# EAGLE design teensy_PCB_v4 (EAGLE 7.7.0)
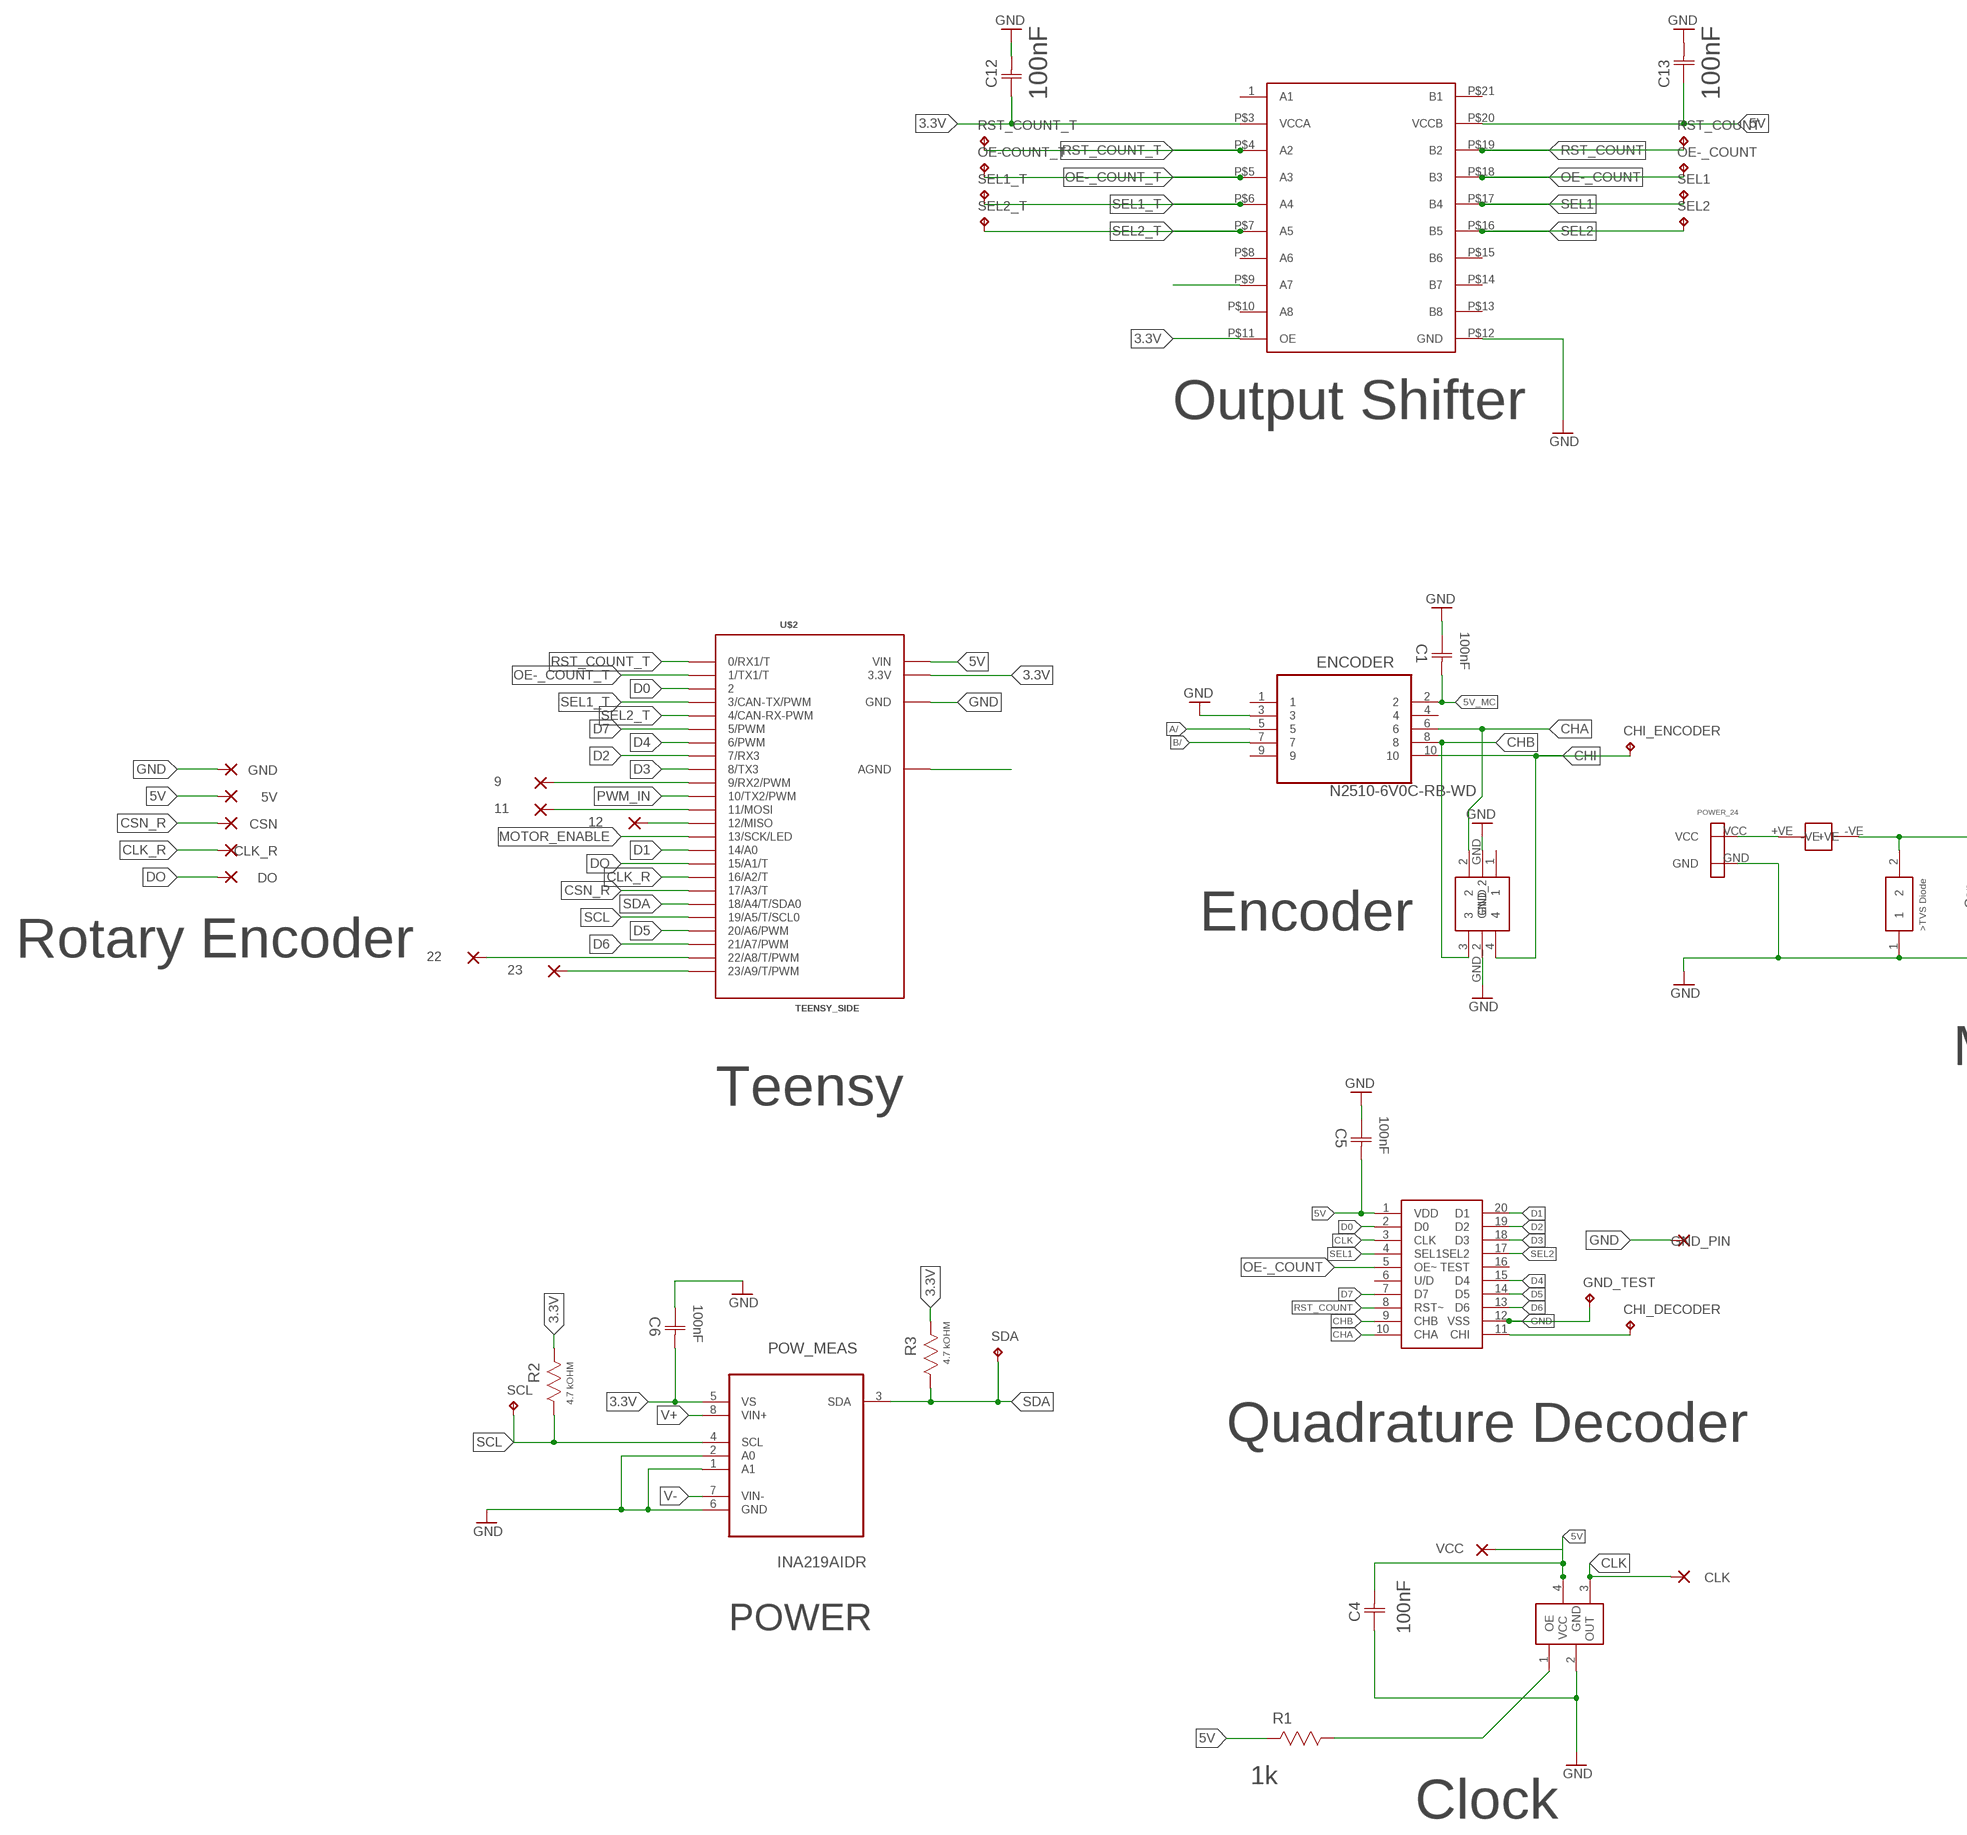
[diagram p0: schematic, sheet 1, part 1 of 2]
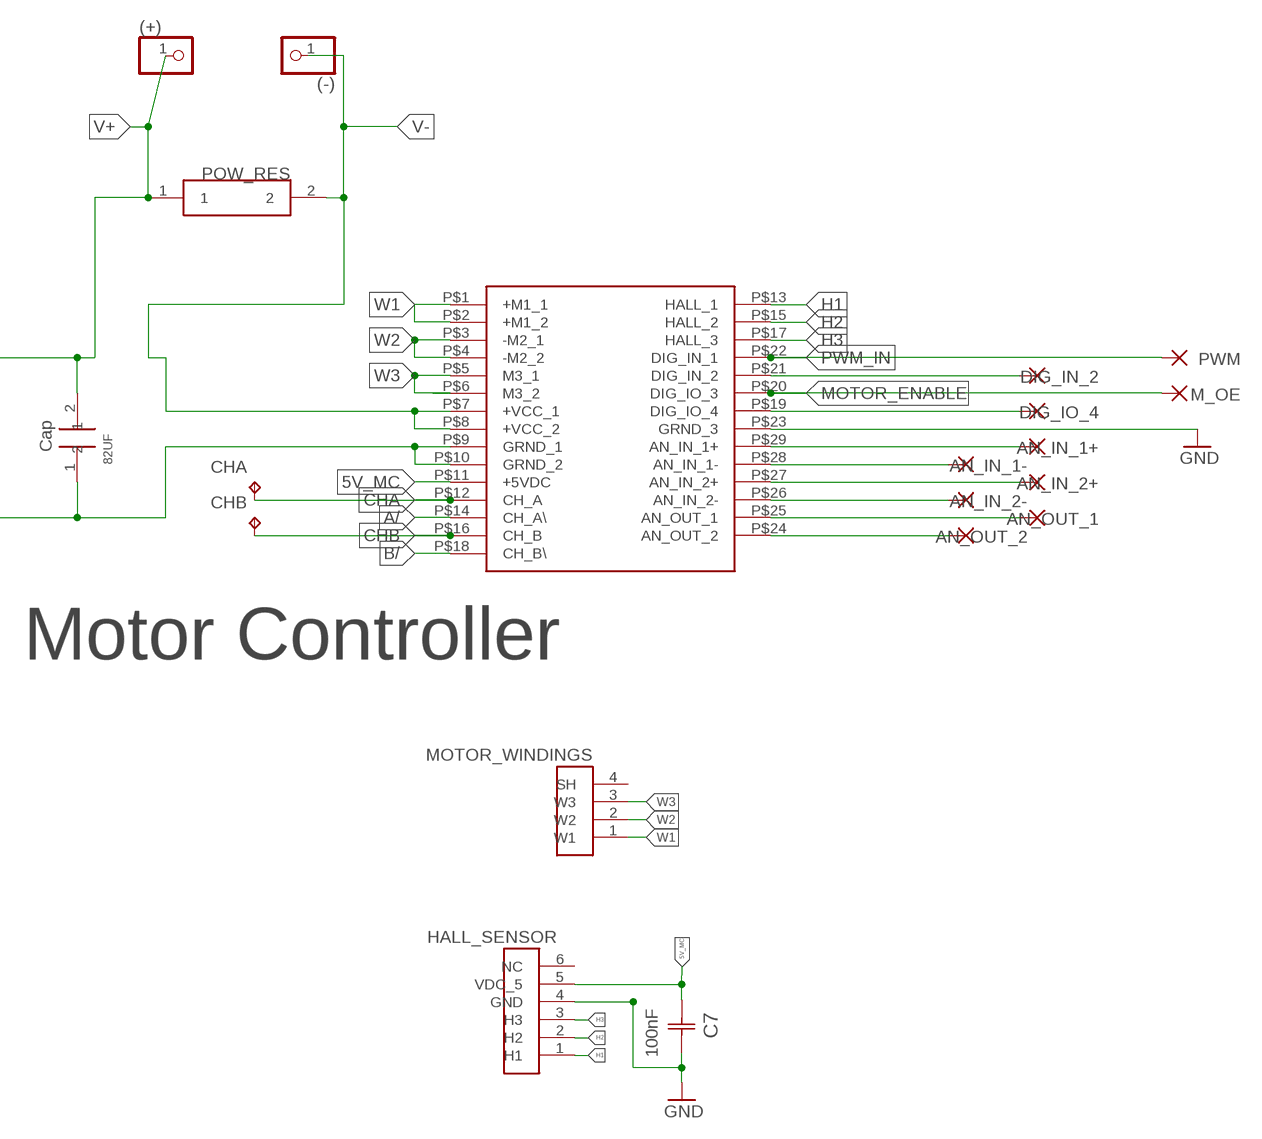
[diagram p1: schematic, sheet 1, part 2 of 2]

## Parts
5V  WIREPAD1,6/0,8  [1,6/0,8]
9  WIREPAD1,6/0,8  [1,6/0,8]
11  WIREPAD1,6/0,8  [1,6/0,8]
12  WIREPAD1,6/0,8  [1,6/0,8]
22  WIREPAD1,6/0,8  [1,6/0,8]
23  WIREPAD1,6/0,8  [1,6/0,8]
(+)  PINHD-1X1  [1X01]
(-)  PINHD-1X1  [1X01]
AN_IN_1+  WIREPAD1,6/0,8  [1,6/0,8]
AN_IN_1-  WIREPAD1,6/0,8  [1,6/0,8]
AN_IN_2+  WIREPAD1,6/0,8  [1,6/0,8]
AN_IN_2-  WIREPAD1,6/0,8  [1,6/0,8]
AN_OUT_1  WIREPAD1,6/0,8  [1,6/0,8]
AN_OUT_2  WIREPAD1,6/0,8  [1,6/0,8]
C1  100nF  U0805F104ZCT  [CAPC2013X90N]
C4  100nF  U0805F104ZCT  [CAPC2013X90N]
C5  100nF  U0805F104ZCT  [CAPC2013X90N]
C6  100nF  U0805F104ZCT  [CAPC2013X90N]
C7  100nF  U0805F104ZCT  [CAPC2013X90N]
C12  100nF  CAP_0805_100NF  [CAP_0805_100NF]
C13  100nF  CAP_0805_100NF  [CAP_0805_100NF]
CAP82UF  82UF  CAP_82UF  [CAP_82UF]
CHA  TPTP10SQ  [TP10SQ]
CHB  TPTP10SQ  [TP10SQ]
CHI_DECODER  TPTP10SQ  [TP10SQ]
CHI_ENCODER  TPTP10SQ  [TP10SQ]
CLK  WIREPAD1,6/0,8  [1,6/0,8]
CLK_R  WIREPAD1,6/0,8  [1,6/0,8]
CLOCK  CLOCK_14MHZ  [CLOCK_14MHZ]
CSN  WIREPAD1,6/0,8  [1,6/0,8]
DIG_IN_2  WIREPAD1,6/0,8  [1,6/0,8]
DIG_IO_4  WIREPAD1,6/0,8  [1,6/0,8]
DO  WIREPAD1,6/0,8  [1,6/0,8]
ENCODER  N2510-6V0C-RB-WD  [3M_N2510-6V0C-RB-WD]
ENCODER_DIODE  ENCODER_DIODE_ESDA14V2BP6  [ENCODER_DIODE_ESDA14V2BP6]
FUSE_HOLDER  FUSE_HOLDER  [FUSE_HOLDER]
GND  WIREPAD1,6/0,8  [1,6/0,8]
GND_PIN  WIREPAD1,6/0,8  [1,6/0,8]
GND_TEST  TPTP10SQ  [TP10SQ]
HALL_SENSOR  HALL_SENSOR_SOCKET_6POS  [HALL_SENSOR_SOCKET_6POS]
M_OE  WIREPAD1,6/0,8  [1,6/0,8]
MOTOR_CONTROLLER  MAXON_438725THROUGH_HOLE  [MAXON_MOTOR_CONTROLLER]
MOTOR_WINDINGS  MOTOR_HEADER_4POS  [MOTOR_HEADER_4POS]
OE-_COUNT  TPTP10SQ  [TP10SQ]
OE-COUNT_T  TPTP10SQ  [TP10SQ]
POW_MEAS  INA219AIDR  [SOIC127P600X175-8N]
POWER_RESISTOR  POWER_RESISTOR  [POWER_RESISTOR]
PWM  WIREPAD1,6/0,8  [1,6/0,8]
QUADRATURE_DECODER  HCTL-2022  [HCTL-2022]
R1  1k  ERA-3AEB102V  [RESC1608X60N]
R2  4.7 kOHM  ERJ-6ENF4701V  [RESC2013X65N]
R3  4.7 kOHM  ERJ-6ENF4701V  [RESC2013X65N]
RST_COUNT  TPTP10SQ  [TP10SQ]
RST_COUNT_T  TPTP10SQ  [TP10SQ]
SCL  TPTP10SQ  [TP10SQ]
SDA  TPTP10SQ  [TP10SQ]
SEL1  TPTP10SQ  [TP10SQ]
SEL1_T  TPTP10SQ  [TP10SQ]
SEL2  TPTP10SQ  [TP10SQ]
SEL2_T  TPTP10SQ  [TP10SQ]
TVS_DIODE  TVS_SMBJ33A-E3/52  [TVS_SMBJ33A-E3/52]
U$2  TEENSY_SIDE  [TEENSY_SIDE]
U$3  TXS0108PWR  [TXS0108PWR]
U$5  POWER_2POS  [POWER_2POS]
VCC  WIREPAD1,6/0,8  [1,6/0,8]

## Nets
3.3V: C6.2(C2) C12.1(C1) POW_MEAS.5(VS) R2.1(R1) R3.1(R1) U$2.3.3V U$3.P$3(VCCA) U$3.P$11(OE)
5V: 5V.1(P) C4.2(C2) C5.2(C2) C13.1(C1) CLOCK.4(VCC) QUADRATURE_DECODER.1(VDD) R1.2(R2) U$2.VIN U$3.P$20(VCCB) VCC.1(P)
5V_MC: C1.2(C2) C7.2(C2) ENCODER.2 HALL_SENSOR.5(VDC_5) MOTOR_CONTROLLER.P$11(+5VDC)
A/: ENCODER.5 MOTOR_CONTROLLER.P$14(CH_A\\)
B/: ENCODER.7 MOTOR_CONTROLLER.P$18(CH_B\\)
CHA: CHA.TP ENCODER.6 ENCODER_DIODE.2 MOTOR_CONTROLLER.P$12(CH_A) QUADRATURE_DECODER.10(CHA)
CHB: CHB.TP ENCODER.8 ENCODER_DIODE.3 MOTOR_CONTROLLER.P$16(CH_B) QUADRATURE_DECODER.9(CHB)
CHI: CHI_ENCODER.TP ENCODER.10 ENCODER_DIODE.4
CLK: CLK.1(P) CLOCK.3(OUT) QUADRATURE_DECODER.3(CLK)
CLK_R: CLK_R.1(P) U$2.16/A2(16/A2/T)
CSN_R: CSN.1(P) U$2.17/A3(17/A3/T)
D0: QUADRATURE_DECODER.2(D0) U$2.2
D1: QUADRATURE_DECODER.20(D1) U$2.14/A0
D2: QUADRATURE_DECODER.19(D2) U$2.7(7/RX3)
D3: QUADRATURE_DECODER.18(D3) U$2.8(8/TX3)
D4: QUADRATURE_DECODER.15(D4) U$2.6(6/PWM)
D5: QUADRATURE_DECODER.14(D5) U$2.20/A6(20/A6/PWM)
D6: QUADRATURE_DECODER.13(D6) U$2.21/A7(21/A7/PWM)
D7: QUADRATURE_DECODER.7(D7) U$2.5(5/PWM)
DO: DO.1(P) U$2.15/A1(15/A1/T)
GND: C1.1(C1) C4.1(C1) C5.1(C1) C6.1(C1) C7.1(C1) C12.2(C2) C13.2(C2) CAP82UF.1 CLOCK.2(GND) ENCODER.3 ENCODER_DIODE.GND ENCODER_DIODE.GND_2 GND.1(P) GND_PIN.1(P) GND_TEST.TP HALL_SENSOR.4(GND) MOTOR_CONTROLLER.P$9(GRND_1) MOTOR_CONTROLLER.P$10(GRND_2) MOTOR_CONTROLLER.P$23(GRND_3) POW_MEAS.1(A1) POW_MEAS.2(A0) POW_MEAS.6(GND) QUADRATURE_DECODER.12(VSS) TVS_DIODE.1 U$2.GND U$3.P$12(GND) U$5.GND
H1: HALL_SENSOR.1(H1) MOTOR_CONTROLLER.P$13(HALL_1)
H2: HALL_SENSOR.2(H2) MOTOR_CONTROLLER.P$15(HALL_2)
H3: HALL_SENSOR.3(H3) MOTOR_CONTROLLER.P$17(HALL_3)
MOTOR_ENABLE: M_OE.1(P) MOTOR_CONTROLLER.P$20(DIG_IO_3) U$2.13(13/SCK/LED)
MOTOR_ENABLE_T: U$3.P$9(A7)
N$1: FUSE_HOLDER.+VE U$5.VCC
N$2: DIG_IN_2.1(P) MOTOR_CONTROLLER.P$21(DIG_IN_2)
N$3: DIG_IO_4.1(P) MOTOR_CONTROLLER.P$19(DIG_IO_4)
N$4: CLOCK.1(OE) R1.1(R1)
N$5: AN_IN_1+.1(P) MOTOR_CONTROLLER.P$29(AN_IN_1+)
N$6: AN_IN_1-.1(P) MOTOR_CONTROLLER.P$28(AN_IN_1-)
N$7: AN_IN_2+.1(P) MOTOR_CONTROLLER.P$27(AN_IN_2+)
N$8: AN_IN_2-.1(P) MOTOR_CONTROLLER.P$26(AN_IN_2-)
N$9: CHI_DECODER.TP QUADRATURE_DECODER.11(CHI)
N$10: AN_OUT_1.1(P) MOTOR_CONTROLLER.P$25(AN_OUT_1)
N$11: AN_OUT_2.1(P) MOTOR_CONTROLLER.P$24(AN_OUT_2)
N$12: 11.1(P) U$2.11(11/MOSI)
N$13: 12.1(P) U$2.12(12/MISO)
N$17: 9.1(P) U$2.9(9/RX2/PWM)
N$35: 22.1(P) U$2.22/A8(22/A8/T/PWM)
N$36: 23.1(P) U$2.23/A9(23/A9/T/PWM)
N$40: U$2.AGND
OE-_COUNT: OE-_COUNT.TP QUADRATURE_DECODER.5(OE~) U$3.P$18(B3)
OE-_COUNT_T: OE-COUNT_T.TP U$2.1(1/TX1/T) U$3.P$5(A3)
PWM_IN: MOTOR_CONTROLLER.P$22(DIG_IN_1) PWM.1(P) U$2.10(10/TX2/PWM)
RST_COUNT: QUADRATURE_DECODER.8(RST~) RST_COUNT.TP U$3.P$19(B2)
RST_COUNT_T: RST_COUNT_T.TP U$2.0(0/RX1/T) U$3.P$4(A2)
SCL: POW_MEAS.4(SCL) R2.2(R2) SCL.TP U$2.19/A5(19/A5/T/SCL0)
SDA: POW_MEAS.3(SDA) R3.2(R2) SDA.TP U$2.18/A4(18/A4/T/SDA0)
SEL1: QUADRATURE_DECODER.4(SEL1) SEL1.TP U$3.P$17(B4)
SEL1_T: SEL1_T.TP U$2.3(3/CAN-TX/PWM) U$3.P$6(A4)
SEL2: QUADRATURE_DECODER.17(SEL2) SEL2.TP U$3.P$16(B5)
SEL2_T: SEL2_T.TP U$2.4(4/CAN-RX-PWM) U$3.P$7(A5)
V+: (+).1 CAP82UF.2 FUSE_HOLDER.-VE POW_MEAS.8(VIN+) POWER_RESISTOR.1 TVS_DIODE.2
V-: (-).1 MOTOR_CONTROLLER.P$7(+VCC_1) MOTOR_CONTROLLER.P$8(+VCC_2) POW_MEAS.7(VIN-) POWER_RESISTOR.2
W1: MOTOR_CONTROLLER.P$1(+M1_1) MOTOR_CONTROLLER.P$2(+M1_2) MOTOR_WINDINGS.1(W1)
W2: MOTOR_CONTROLLER.P$3(-M2_1) MOTOR_CONTROLLER.P$4(-M2_2) MOTOR_WINDINGS.2(W2)
W3: MOTOR_CONTROLLER.P$5(M3_1) MOTOR_CONTROLLER.P$6(M3_2) MOTOR_WINDINGS.3(W3)
Unconnected: ENCODER.1 ENCODER.4 ENCODER.9 ENCODER_DIODE.1 HALL_SENSOR.6(NC) MOTOR_WINDINGS.4(SH) QUADRATURE_DECODER.6(U/D) QUADRATURE_DECODER.16(TEST) U$3.1(A1) U$3.P$8(A6) U$3.P$10(A8) U$3.P$13(B8) U$3.P$14(B7) U$3.P$15(B6) U$3.P$21(B1)

## Notes on the sheet
- Output Shifter
- Encoder
- Rotary Encoder
- Motor Controller
- Teensy
- Quadrature Decoder
- POWER
- Clock
- By Aaron Chong Tze Hao, 20/04/2016
  This schematic is released under the 
  Creative Commons ShareAlike 4.0 International license.

## Library data of the parts
5V 9 11 12 22 23 AN_IN_1+ AN_IN_1- AN_IN_2+ AN_IN_2- AN_OUT_1 AN_OUT_2 CLK CLK_R CSN DIG_IN_2 DIG_IO_4 DO GND GND_PIN M_OE PWM VCC = wirepad:WIREPAD: Wire PAD connect wire on PCB
(+) (-) = adafruit:PINHD-1X1: Pin header 1x1 for 0.1" spacing With round pins
C1 C4-C7 = CAP_100nF:U0805F104ZCT: CAPACITOR, 0805; MPN: U0805F104ZCT; OC_FARNELL: 9406409; OC_NEWARK: 38K9281; SUPPLIER: Multicomp; TOLERANCE: -20/+80%; VOLTAGERATING: 50V
C12 C13 = cap_0805:CAP_0805_100NF: CAPACITOR, 0805; MPN: U0805F104ZCT; OC_FARNELL: 9406409; OC_NEWARK: 38K9281; SUPPLIER: Multicomp; TOLERANCE: -20/+80%; VOLTAGERATING: 50V
CAP82UF = CAP_82UF:CAP_82UF
CHA CHB CHI_DECODER CHI_ENCODER GND_TEST OE-_COUNT OE-COUNT_T RST_COUNT RST_COUNT_T SCL SDA SEL1 SEL1_T SEL2 SEL2_T = testpad:TP: Test pad
CLOCK = CLOCK_14MHZ:CLOCK_14MHZ
ENCODER = Encoder_connector_10POS:N2510-6V0C-RB-WD: Header; MPN: N2510-6V0C-RB-WD; OC_FARNELL: 1428501; OC_NEWARK: 02P7333; PACKAGE: Header-10Pin; SUPPLIER: 3M
ENCODER_DIODE = ENCODER_DIODE_ESDA14V2BP6:ENCODER_DIODE_ESDA14V2BP6
FUSE_HOLDER = fuse_holder_new:FUSE_HOLDER
HALL_SENSOR = HALL_SENSOR_SOCKET_6POS:HALL_SENSOR_SOCKET_6POS
MOTOR_CONTROLLER = maxon_motor_controller:MAXON_438725
MOTOR_WINDINGS = MOTOR_HEADER_4POS:MOTOR_HEADER_4POS
POW_MEAS = Texas Instruments_By_element14_Batch_1:INA219AIDR: CURRENT/POWER MONITOR; MPN: INA219AIDR; OC_FARNELL: -; OC_NEWARK: 45P7636; PACKAGE: SOIC-8; SUPPLIER: TEXAS INSTRUMENTS
POWER_RESISTOR = POWER_RESISTOR:POWER_RESISTOR
QUADRATURE_DECODER = HCTL-2022:HCTL-2022
R1 = Panasonic_By_element14_Batch_1:ERA-3AEB102V: RESISTOR, 0603; MPN: ERA-3AEB102V; OC_FARNELL: 1811362; OC_NEWARK: 08N2094; SUPPLIER: Panasonic; TOLERANCE: ±0.1%; VALUE: 1 kOhm; WATTAGE: 0.1 W
R2 R3 = 0805resistor:ERJ-6ENF4701V: RESISTOR, 0805; MPN: ERJ-6ENF4701V; OC_FARNELL: 1748374; OC_NEWARK: 64R5410; SUPPLIER: Panasonic; TOLERANCE: ± 1 %; WATTAGE: 0.125 W
TVS_DIODE = TVS_SMBJ33A-E3:TVS_SMBJ33A-E3/52
U$2 = Teensy3.0:TEENSY_SIDE
U$3 = TXS0108PWR:TXS0108PWR
U$5 = POWER_2POS:POWER_2POS

## Board
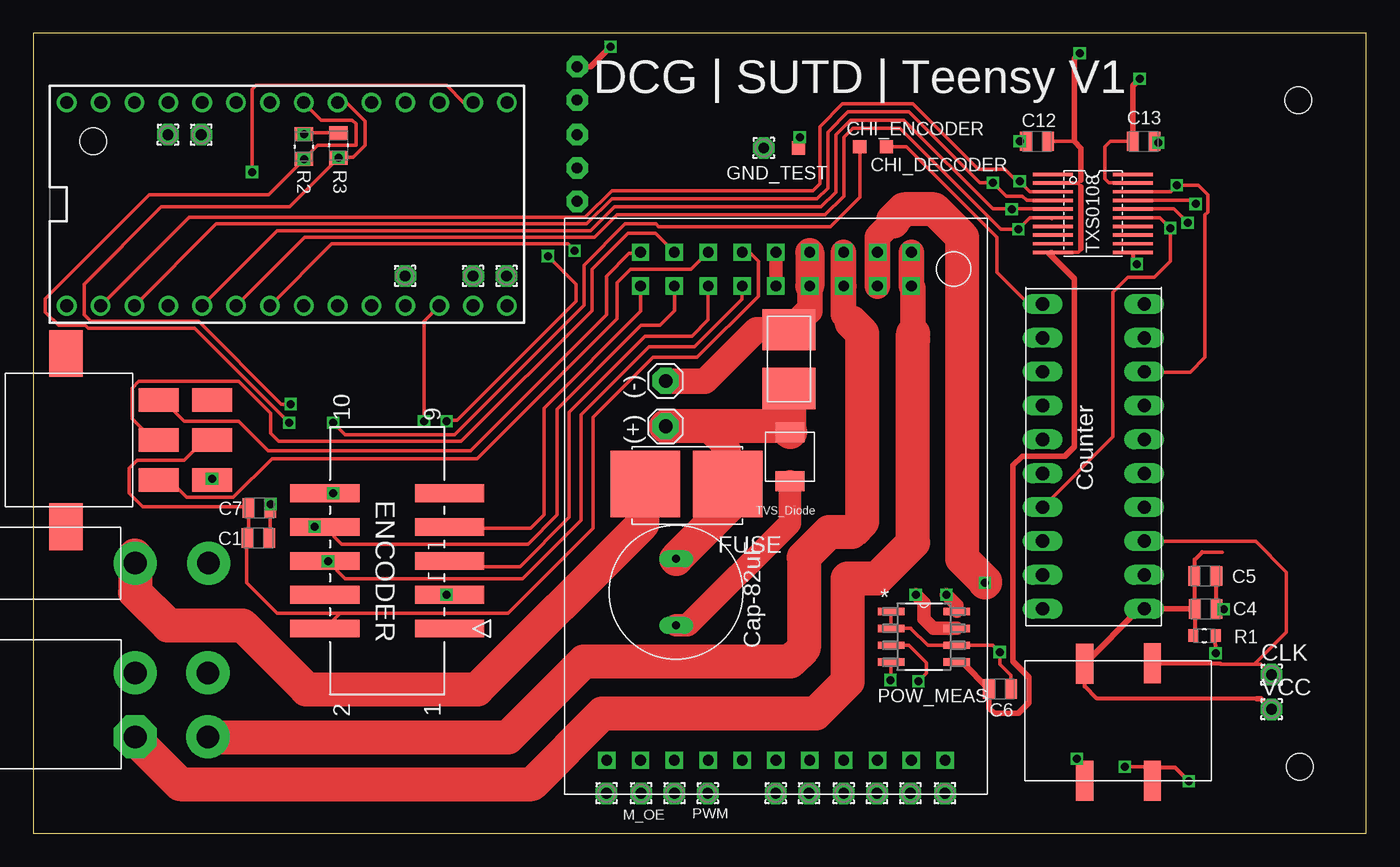
[diagram p2: board, top side]
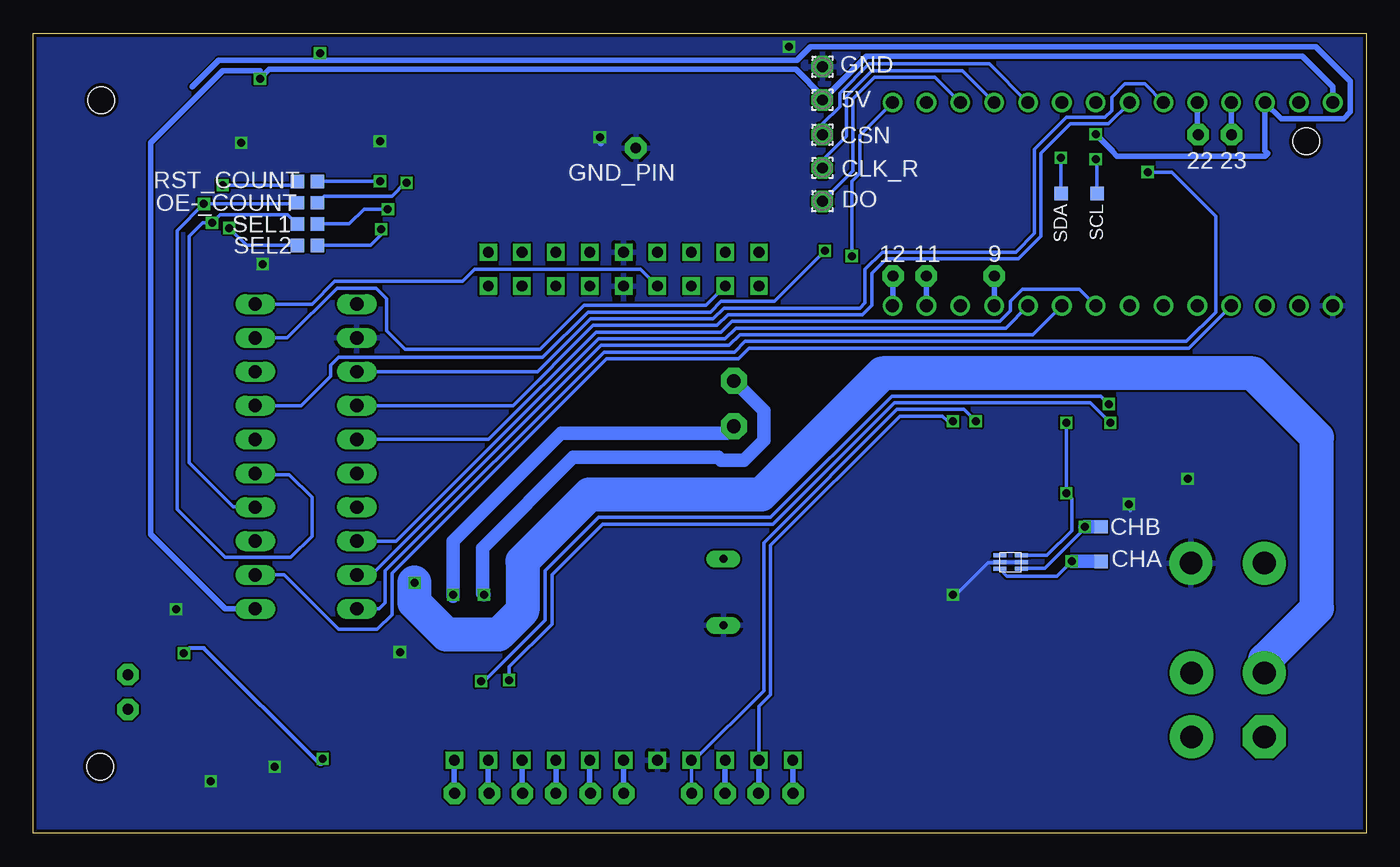
[diagram p3: board, bottom side, seen from below]

Size 100 x 60 mm. Coordinates in mm from the lower left corner, seen from the top.
Outline: 0,0 100,0 100,60 0,60 0,0
Copper layers (1*16): Top 0.035mm / dielectric 1.5mm / Bottom 0.035mm
Design rules "SeeedStudio_2layer_DRU_no_angle_20140221 *": minimum track width 6mil, minimum drill 12mil, track to track 6mil, track to pad 6mil, pad to pad 6mil, via to via 6mil, smd to smd 0mil, copper to edge 10mil, drill to drill 10mil, minimum pad ring 10mil, minimum via ring 6mil, stop-mask expansion 2mil, vias tented up to drill 100mil, thermal gap 10mil
Holes 2 mm at 4.5,51.9 94.9,55 95,5

### Footprints (pad centres in the part's own frame; a part is rotated, then mirrored left to right if it is on the bottom)
1,6/0,8 = drill 0.813 pad 1.6 octagon: 1 0,0
1X01 = drill 1.016 pad 1.93 octagon: 1 0,0
CAPC2013X90N = smd 0.914 x 1.448: 1 -0.813,0; 2 0.813,0
CAP_0805_100NF = smd 0.914 x 1.448: 1 -0.813,0; 2 0.813,0
CAP_82UF = drill 0.6 pad 1.27 long: 1 0,2.5; 2 0,-2.5
TP10SQ = smd 1 x 1: TP 0,0
CLOCK_14MHZ = smd 1.3 x 3: 1 0,0; 2 5.08,0; 3 5.08,8.81; 4 0,8.8
3M_N2510-6V0C-RB-WD = smd 1.321 x 5.182: 1 -5.08,-4.674; 2 -5.08,4.674; 3 -2.54,-4.674; 4 -2.54,4.674; 5 0,-4.674; 6 0,4.674; 7 2.54,-4.674; 8 2.54,4.674; 9 5.08,-4.674; 10 5.08,4.674
ENCODER_DIODE_ESDA14V2BP6 = smd 0.3 x 0.99: 1 0,0; 2 1,0; 3 1,1.61; 4 0,1.61; GND 0.5,0; GND_2 0.5,1.61
FUSE_HOLDER = smd 5.2 x 5: +VE 1,3; -VE 7.2,3
HALL_SENSOR_SOCKET_6POS = smd 1.75 x 3: 1 -8,-11.5; 2 -5,-11.5; 3 -2,-11.5; 4 -8,-15.5; 5 -5,-15.5; 6 -2,-15.5 | smd 3.5 x 2.54: BASE1 -11.5,-4.55; BASE2 1.5,-4.55
MAXON_MOTOR_CONTROLLER = drill 0.8 square: P$1 2.54,26.035; P$2 5.08,26.035; P$3 2.54,23.495; P$4 5.08,23.495; P$5 2.54,20.955; P$6 5.08,20.955; P$7 2.54,18.415; P$8 5.08,18.415; P$9 2.54,15.875; P$10 5.08,15.875; P$11 2.54,13.335; P$12 5.08,13.335; P$13 2.54,10.795; P$14 5.08,10.795; P$15 2.54,8.255; P$16 5.08,8.255; P$17 2.54,5.715; P$18 5.08,5.715; P$19 40.64,3.175; P$20 40.64,5.715; P$21 40.64,8.255; P$22 40.64,10.795; P$23 40.64,13.335; P$24 40.64,15.875; P$25 40.64,18.415; P$26 40.64,20.955; P$27 40.64,23.495; P$28 40.64,26.035; P$29 40.64,28.575
MOTOR_HEADER_4POS = drill 1.7 pad 3.226 octagon: 1 2.4,-1.05 | drill 1.7 pad 3.226: 2 7.2,-1.05; 3 2.4,-6.5; 4 7.2,-6.5
SOIC127P600X175-8N = smd 1.981 x 0.559: 1 -2.464,1.905; 2 -2.464,0.635; 3 -2.464,-0.635; 4 -2.464,-1.905; 5 2.464,-1.905; 6 2.464,-0.635; 7 2.464,0.635; 8 2.464,1.905
POWER_RESISTOR = smd 3.1 x 4: 1 1.55,2; 2 5.95,2
HCTL-2022 = drill 1 long: 1 1.27,1.27; 2 3.81,1.27; 3 6.35,1.27; 4 8.89,1.27; 5 11.43,1.27; 6 13.97,1.27; 7 16.51,1.27; 8 19.05,1.27; 9 21.59,1.27; 10 24.13,1.27; 11 24.13,8.89; 12 21.59,8.89; 13 19.05,8.89; 14 16.51,8.89; 15 13.97,8.89; 16 11.43,8.89; 17 8.89,8.89; 18 6.35,8.89; 19 3.81,8.89; 20 1.27,8.89
RESC1608X60N = smd 0.762 x 0.94: 1 -0.838,0; 2 0.838,0
RESC2013X65N = smd 1.016 x 1.397: 1 -0.94,0; 2 0.94,0
TVS_SMBJ33A-E3/52 = smd 1.52 x 2.18: 1 0,0; 2 3.679,0
TEENSY_SIDE = drill 0.965: 0 1.27,31.75; 1 1.27,29.21; 2 1.27,26.67; 3 1.27,24.13; 3.3V 16.51,29.21; 4 1.27,21.59; 5 1.27,19.05; 6 1.27,16.51; 7 1.27,13.97; 8 1.27,11.43; 9 1.27,8.89; 10 1.27,6.35; 11 1.27,3.81; 12 1.27,1.27; 13 16.51,1.27; 14/A0 16.51,3.81; 15/A1 16.51,6.35; 16/A2 16.51,8.89; 17/A3 16.51,11.43; 18/A4 16.51,13.97; 19/A5 16.51,16.51; 20/A6 16.51,19.05; 21/A7 16.51,21.59; 22/A8 16.51,24.13; 23/A9 16.51,26.67; AGND 16.51,31.75; GND 1.27,34.29; VIN 16.51,34.29
TXS0108PWR = smd 3 x 0.25: 1 -0.8,6.125; P$3 -0.8,5.475; P$4 -0.8,4.825; P$5 -0.8,4.175; P$6 -0.8,3.525; P$7 -0.8,2.875; P$8 -0.8,2.225; P$9 -0.8,1.575; P$10 -0.8,0.925; P$11 -0.8,0.275; P$12 5.2,0.275; P$13 5.2,0.925; P$14 5.2,1.575; P$15 5.2,2.225; P$16 5.2,2.875; P$17 5.2,3.525; P$18 5.2,4.175; P$19 5.2,4.825; P$20 5.2,5.475; P$21 5.2,6.125
POWER_2POS = drill 1.7 pad 3.226: GND 2.7,-6.6; VCC 2.7,-1.1

### Placement (x,y rotation side)
5V  40.8,55 0 bottom
9  27.9,41.8 0 top
11  33,41.8 0 top
12  35.5,41.8 0 top
22  12.6,52.4 0 top
23  10.1,52.4 0 top
(+)  47.44,30.53 90 top
(-)  47.44,33.94 90 top
AN_IN_1+  68.4,3 0 top
AN_IN_1-  65.8,3 0 top
AN_IN_2+  63.3,3 0 top
AN_IN_2-  60.8,3 0 top
AN_OUT_1  58.2,3 0 top
AN_OUT_2  55.7,3 0 top
C1  16.89,22.15 180 top
C4  87.95,16.82 180 top
C5  87.92,19.3 180 top
C6  72.52,10.82 180 top
C7  16.96,24.4 180 top
C12  75.3,51.9 180 top
C13  83.3,51.9 0 top
CAP82UF  48.23,18.09 180 top
CHA  19.9,20.4 0 bottom
CHB  19.9,23 0 bottom
CHI_DECODER  64,51.5 0 top
CHI_ENCODER  62,51.5 0 top
CLK  92.9,11.9 0 top
CLK_R  40.8,49.9 0 bottom
CLOCK  78.88,3.93 0 top
CSN  40.8,52.4 0 bottom
DIG_IN_2  48.1,3 0 top
DIG_IO_4  43,3 0 top
DO  40.8,47.4 0 bottom
ENCODER  26.55,20.43 90 top
ENCODER_DIODE  27.49,20.84 270 bottom
FUSE_HOLDER  44.9,23.2 0 top
GND  40.8,57.5 0 bottom
GND_PIN  54.8,51.4 0 top
GND_TEST  57.4,51.4 0 top
HALL_SENSOR  -2.1,34.5 90 top
M_OE  45.6,3 0 top
MOTOR_CONTROLLER  39.84,46.12 270 top
MOTOR_WINDINGS  6.6,4.83 90 top
OE-_COUNT  80.2,47.3 0 bottom
OE-COUNT_T  78.7,47.3 0 bottom
POW_MEAS  66.82,14.74 0 top
POWER_RESISTOR  58.69,31.82 90 top
PWM  50.6,3 0 top
QUADRATURE_DECODER  84.62,15.57 90 top
R1  87.86,14.82 180 top
R2  20.3,51.5 270 top
R3  22.9,51.6 270 top
RST_COUNT  80.2,48.9 0 bottom
RST_COUNT_T  78.7,48.9 0 bottom
SCL  20.2,48 180 bottom
SDA  22.9,48 180 bottom
SEL1  80.2,45.7 0 bottom
SEL1_T  78.7,45.7 0 bottom
SEL2  80.2,44.1 0 bottom
SEL2_T  78.7,44.1 0 bottom
TVS_DIODE  56.77,26.41 90 top
U$2  36.8,38.3 90 top
U$3  77.3,43.3 0 top
U$5  6.54,17.57 90 top
VCC  92.9,9.3 0 top

### Tracks (layer width: path | path; a pad name or v marks a point on that pad's centre or on a via)
3.3V  (via drill 0.6)
  Top 0.254: POW_MEAS.5 69.69,12.84 | 78.35,48.75 arc45 78.28,48.77 U$3.P$3 | 78.35,48.75 78.6,48.5 | 78.6,43.84 arc-45 78.57,43.77 78.4,43.6 76.56,43.6 arc45 U$3.P$11 | R2.1 20.4,52.54 20.8,52.54 R3.1 | C12.1 78.1,51.9 | 78.6,48.99 78.35,48.75
  Top 0.305: U$3.P$11 76.28,43.58 76.2,43.5 | C6.2
  Top 0.406: R2.1 20.7,52.44 20.8,52.54 | v78.5,58.5 78.1,58.1 78.1,51.9 78.6,51.4 78.6,48.99 | 69.69,12.84 C6.2 | C6.2 71.7,9.4 72.1,9 73.9,9 74.7,9.8 74.7,11.7 73.5,12.9 73.5,27.6 74.2,28.3 77.4,28.3 78.1,29 78.1,41.6 76.2,43.5 | 78.6,48.5 78.6,43.84
  Bottom 0.406: 78.5,58 42.7,58 41.7,59 3.8,59 1.2,56.4 1.2,54.1 1.7,53.6 6.38,53.6 U$2.3.3V 7.59,51.19 7.4,51 7.6,50.8 18.7,50.8 19.05,51.15 19.05,51.19 R2.1 | 88.1,56 86.1,58 78.5,58 | v78.5,58.5 78.5,58
  other vias: 20.3,52.44
5V  (via drill 0.6)
  Top 0.254: 87.7,21.1 89.2,21.1 | C13.1 80.8,51.9 80.4,51.5 80.4,49.1 80.7,48.8 82.47,48.8 U$3.P$20
  Top 0.305: 79.24,12.73 CLOCK.4 78.88,11.02 79.8,10.1 91.8,10.1 | 87.14,19.27 C4.2 87.14,14.94 R1.2 | 87.14,19.27 C5.2 | 87.14,19.27 87.14,20.54 87.7,21.1
  Top 0.406: C13.1 82.49,56.09 v83,56.6 | CLOCK.4 82.99,16.84 QUADRATURE_DECODER.1 87.12,16.84 C4.2 | 91.8,10.1 92.1,10.1 VCC.1
  Bottom 0.406: QUADRATURE_DECODER.1 85.6,16.84 91.2,22.44 91.2,51.8 85.8,57.2 83,57.2 v83,56.6 82.3,57.3 42.8,57.3 40.8,55.3 5V.1 37.5,58.3 4.8,58.3 2.51,56.01 U$2.VIN
5V_MC
  Top 0.254: MOTOR_CONTROLLER.P$11 53.72,43.58 54.4,42.9 54.4,40.3 49.8,35.7 46.5,35.7 42,31.2 42,22.9 35.6,16.5 23.03,16.5 | 23.03,16.5 ENCODER.2 | 13.5,29.5 HALL_SENSOR.5 12.8,29.5 11.3,28 7.8,28 7.2,27.4 7.2,25.5 8.2,24.5 16.05,24.5 C7.2 | 16.1,24.45 C7.2 | C7.2 16.15,22.22 C1.2 16,22.07 16,18.8 18.3,16.5 23.03,16.5
A/
  Top 0.254: MOTOR_CONTROLLER.P$14 50.63,38.53 49.4,37.3 45.9,37.3 40.2,31.6 40.2,23.7 36.5,20 31.65,20 ENCODER.5
B/
  Top 0.254: 45.7,41.1 45.64,41.04 MOTOR_CONTROLLER.P$18 45.55,39.16 38.3,31.9 38.3,23.9 37.3,22.9 31.29,22.9 ENCODER.7
CHA  (via drill 0.6)
  Top 0.254: ENCODER.6 22.07,20.43 v22.1,20.4 23.4,19.1 36.7,19.1 41.1,23.5 41.1,31.4 46.2,36.5 49.6,36.5 53.17,40.08 MOTOR_CONTROLLER.P$12
  Bottom 0.254: v22.1,20.4 23.2,19.3 26.95,19.3 ENCODER_DIODE.2 | QUADRATURE_DECODER.10 79.1,39.7 77.4,41.4 67.8,41.4 66.9,42.3 54.44,42.3 MOTOR_CONTROLLER.P$12
  Bottom 1.016: CHA.TP v22.1,20.4
CHB  (via drill 0.6)
  Top 0.254: v21.1,23 21.13,22.97 ENCODER.8 23.15,21.7 37.1,21.7 39.3,23.9 39.3,31.8 45.6,38.1 47,38.1 48.09,39.2 MOTOR_CONTROLLER.P$16
  Bottom 0.254: v21.1,23 21.1,22.9 24.1,19.9 25.82,19.9 ENCODER_DIODE.3 | QUADRATURE_DECODER.9 80.94,37.16 77.2,40.9 74.3,40.9 73.5,40.1 73.5,37.7 72.1,36.3 62,36.3 58.7,39.6 49.53,39.6 MOTOR_CONTROLLER.P$16
  Bottom 1.016: CHB.TP v21.1,23
CHI  (via drill 0.6)
  Top 0.254: CHI_ENCODER.TP 62,47.7 59.8,45.5 46.9,45.5 46.7,45.7 44.4,45.7 41.3,42.6 41.3,39.6 31.6,29.9 23.4,29.9 v22.5,30.8 | v22.5,25.5 ENCODER.10
  Bottom 0.254: ENCODER_DIODE.4 23.96,20.84 22.1,22.7 22.1,25.1 v22.5,25.5 v22.5,30.8
CLK
  Top 0.254: 89.08,12.7 91.6,12.7 | 91.6,12.7 94,15.1 94,19.6 91.7,21.9 83.37,21.9 | 91.6,12.7 92.1,12.7 CLK.1
  Top 0.305: CLOCK.3 89.04,12.74 89.08,12.7 | 83.37,21.9 QUADRATURE_DECODER.3
CLK_R
  Bottom 0.254: CLK_R.1 40.8,50.5 39,52.3 39,55.3 37.1,57.2 30.3,57.2 U$2.16/A2
CSN_R
  Bottom 0.254: CSN.1 40.8,53.2 39.5,54.5 39.5,55.5 37.3,57.7 28.26,57.7 U$2.17/A3
D0
  Bottom 0.254: QUADRATURE_DECODER.2 81.18,19.38 77.1,15.3 74.2,15.3 73.1,16.4 73.1,19.5 57,35.6 47.1,35.6 46.3,36.4 13.3,36.4 U$2.2
D1  (via drill 0.6)
  Top 0.254: U$2.14/A0 32.29,54.81 31,56.1 16.7,56.1 16.4,55.8 v16.4,49.6
  Bottom 0.254: QUADRATURE_DECODER.20 74.06,16.84 73.6,17.3 73.6,19.7 57.2,36.1 47.4,36.1 46.6,36.9 13.5,36.9 11.3,39.1 11.3,46.3 14.6,49.6 v16.4,49.6
D2
  Bottom 0.254: QUADRATURE_DECODER.19 74.62,19.38 57.4,36.6 47.8,36.6 47,37.4 25,37.4 U$2.7
D3
  Bottom 0.254: QUADRATURE_DECODER.18 72.78,21.92 57.6,37.1 48.1,37.1 47.3,37.9 27.04,37.9 U$2.8
D4
  Bottom 0.254: QUADRATURE_DECODER.15 65.86,29.54 57.8,37.6 48.4,37.6 47.6,38.4 27.5,38.4 26.7,39.2 26.7,39.9 25.8,40.8 21.52,40.8 U$2.6
D5
  Bottom 0.254: QUADRATURE_DECODER.14 64.02,32.08 58,38.1 48.7,38.1 47.9,38.9 37.8,38.9 37.1,39.6 37.1,42 36,43.1 26.1,43.1 24.4,44.8 24.4,51 22.2,53.2 19.36,53.2 U$2.20/A6
D6
  Bottom 0.254: QUADRATURE_DECODER.13 62.18,34.62 58.2,38.6 49,38.6 48.2,39.4 38,39.4 37.6,39.8 37.6,42.3 36.3,43.6 26.3,43.6 24.9,45 24.9,51.3 22.5,53.7 19.6,53.7 19.1,54.2 19.1,55.2 18.1,56.2 16.6,56.2 U$2.21/A7
D7  (via drill 0.6)
  Top 0.254: v40.6,43.7 40.1,44.2 22.38,44.2 U$2.5
  Bottom 0.254: QUADRATURE_DECODER.7 79.92,32.08 77.7,34.3 77.7,35.1 77.1,35.7 61.8,35.7 58.4,39.1 49.2,39.1 48.4,39.9 44.4,39.9 v40.6,43.7
DO
  Bottom 0.254: DO.1 38.5,49.7 38.5,55.1 36.9,56.7 32.34,56.7 U$2.15/A1
GND  (via drill 0.6)
  Top 0.254: POW_MEAS.1 POW_MEAS.2 65.78,15.38 arc-45 65.85,15.35 67.1,14.1 POW_MEAS.6 arc45 POW_MEAS.6 71.95,14.11 arc-45 72.02,14.08 v72.5,13.6 72.5,12.7 73.33,11.87 C6.1 | ENCODER.3 v31.01,17.89 v31,17.9 | C13.2 84.3,51.9 v84.4,51.8 | C12.2 v74,51.9 | C1.1 17.77,22.22 C7.1 17.77,24.67 v17.8,24.7 | HALL_SENSOR.4 v13.4,26.6
  Top 0.305: CLOCK.2 83.96,4.94 | 83.96,4.94 v81.9,5 | 83.96,4.94 85.66,4.94 v86.7,3.9 | C5.1 88.76,19.27 C4.1 89.28,16.82 v89.3,16.8 | U$3.P$12 82.5,43 v82.8,42.7
  Top 0.406: GND_TEST.TP 57.4,52.1 v57.5,52.2 | GND.1 41.8,57.5 v43.3,59
  Top 1.016: MOTOR_CONTROLLER.P$9 MOTOR_CONTROLLER.P$10
  Top 1.676: TVS_DIODE.1 56.77,23.27 49.09,15.59 CAP82UF.1
  Bottom 0.254: v72.5,13.6 72.5,13.54 arc-45 72.47,13.47 72.4,13.4 | ENCODER_DIODE.GND_2 ENCODER_DIODE.GND 27.53,20.3 28.4,20.3 30.8,17.9 v31,17.9 | v84.4,51.8 84.2,51.8 | v74,51.9 74.3,51.9 | v17.8,24.7 17.8,24.3 17.7,24.2 | v13.4,26.6 13.4,26.4
  Bottom 0.305: v81.9,5 81.9,4.9 | v86.7,3.9 86.9,3.7 | v89.3,16.8 89.2,16.8 | v82.8,42.7 82.9,42.8
  Bottom 0.406: v57.5,52.2 57.5,51.8 57.4,51.7 | v43.3,59 43.4,58.9
  pour Bottom: -5.8,67.2 110,68.2 111.3,-6.1 -7.5,-6.1
H1
  Top 0.254: MOTOR_CONTROLLER.P$13 49.35,42.3 44.8,42.3 43.8,41.3 43.8,38.6 33.3,28.1 17.9,28.1 15,25.2 11.5,25.2 9.6,27.1 9.4,27.1 HALL_SENSOR.1
H2
  Top 0.254: MOTOR_CONTROLLER.P$15 46.67,45 44.6,45 41.9,42.3 41.9,39.2 32.1,29.4 18.4,29.4 17.8,30 17.8,31.5 15.4,33.9 7.9,33.9 7.4,33.4 7.4,31.1 9,29.5 HALL_SENSOR.2
H3
  Top 0.254: MOTOR_CONTROLLER.P$17 45.48,43.5 44.7,43.5 43,41.8 43,38.9 32.8,28.7 29.5,28.7 29,28.7 17.6,28.7 15.4,30.9 11.3,30.9 9.7,32.5 HALL_SENSOR.3
MOTOR_ENABLE  (via drill 0.6)
  Top 0.254: v38.6,43.3 40.7,41.2 40.7,39.9 31.8,31 31.1,31 v31,30.9
  Bottom 0.254: MOTOR_CONTROLLER.P$20 45.55,9.54 44.7,10.4 44.7,21.6 35,31.3 31.8,31.3 31.4,30.9 v31,30.9 | v38.6,43.3 38.6,48.9 38,49.5 38,52.34 U$2.13
  Bottom 0.406: MOTOR_CONTROLLER.P$20 45.55,3.04 M_OE.1
N$1
  Top 2.54: 7.64,20.84 U$5.VCC 7.64,18.06 10.1,15.6 15.7,15.6 20.5,10.8 33.3,10.8 45.7,23.2 45.7,25 FUSE_HOLDER.+VE
N$2
  Bottom 0.406: MOTOR_CONTROLLER.P$21 DIG_IN_2.1
N$3
  Bottom 0.406: MOTOR_CONTROLLER.P$19 43.02,3.02 DIG_IO_4.1
N$4  (via drill 0.6)
  Top 0.305: CLOCK.1 78.88,5.02 v78.3,5.6 | v88.7,13.5 R1.1
  Bottom 0.305: v78.3,5.6 78.3,5.3 78.4,5.2 78.5,5.2 87.2,13.9 88.3,13.9 v88.7,13.5
N$5
  Bottom 0.406: MOTOR_CONTROLLER.P$29 68.42,3.02 AN_IN_1+.1
N$6
  Bottom 0.406: MOTOR_CONTROLLER.P$28 65.88,3.08 AN_IN_1-.1
N$7
  Bottom 0.406: MOTOR_CONTROLLER.P$27 63.34,3.04 AN_IN_2+.1
N$8
  Bottom 0.406: MOTOR_CONTROLLER.P$26 AN_IN_2-.1
N$9
  Top 0.254: QUADRATURE_DECODER.11 74.7,39.7 72.3,42.1 72.3,44.7 65.5,51.5 CHI_DECODER.TP
N$10
  Bottom 0.406: MOTOR_CONTROLLER.P$25 58.26,3.06 AN_OUT_1.1
N$11
  Bottom 0.406: MOTOR_CONTROLLER.P$24 55.72,3.02 AN_OUT_2.1
N$12
  Bottom 0.406: 11.1 U$2.11
N$13
  Bottom 0.406: 12.1 35.5,39.6 U$2.12
N$17
  Bottom 0.406: 9.1 U$2.9
N$35
  Bottom 0.406: U$2.22/A8 12.67,52.47 22.1
N$36
  Bottom 0.406: U$2.23/A9 10.13,52.43 23.1
OE-_COUNT  (via drill 0.6)
  Top 0.254: U$3.P$18 86.92,47.48 v87.2,47.2
  Bottom 0.254: QUADRATURE_DECODER.5 83.25,26.9 80.8,26.9 79.1,25.2 79.1,22.3 80.7,20.7 85.6,20.7 89.2,24.3 89.2,45.2 v87.2,47.2 80.3,47.2 OE-_COUNT.TP
OE-_COUNT_T  (via drill 0.6)
  Top 0.254: U$2.1 13.72,45.7 41.5,45.7 43.4,47.6 58.8,47.6 59.6,48.4 59.6,52.6 61.1,54.1 65.7,54.1 71,48.8 v72,48.8 73,47.8 74.2,47.8 74.53,47.48 U$3.P$5
  Bottom 0.254: v72,48.8 72.1,48.8 73.1,47.8 78.2,47.8 OE-COUNT_T.TP
PWM_IN  (via drill 0.6)
  Top 0.254: v29.3,30.9 29.3,38.42 U$2.10
  Bottom 0.254: 50.63,3.04 MOTOR_CONTROLLER.P$22 50.42,5.48 45.2,10.7 45.2,21.8 35.2,31.8 30.2,31.8 v29.3,30.9
  Bottom 0.406: PWM.1 50.63,3.04
RST_COUNT  (via drill 0.6)
  Top 0.254: QUADRATURE_DECODER.8 83.37,34.6 86.8,34.6 87.9,35.7 87.9,46.4 88.1,46.6 88.1,47.9 87.4,48.6 v85.8,48.6 85.33,48.12 U$3.P$19
  Bottom 0.254: v85.8,48.6 80.5,48.6 RST_COUNT.TP
RST_COUNT_T  (via drill 0.6)
  Top 0.254: U$2.0 11.68,46.2 41.4,46.2 43.4,48.2 58.5,48.2 59,48.7 59,53 60.7,54.7 66,54.7 70.9,49.8 72.9,49.8 73.8,48.9 v74,48.9 74.78,48.12 U$3.P$4
  Bottom 0.254: v74,48.9 RST_COUNT_T.TP
SCL  (via drill 0.6)
  Top 0.254: 20.44,50.56 R2.2 | R2.2 21.34,51.6 24.2,51.6 24.2,53.2 23.9,53.5 21.6,53.5 U$2.19/A5 | POW_MEAS.4 64.36,11.56 v64.3,11.5 | R2.2 17.64,47.9 8.7,47.9 0.9,40.1 0.9,39.1 1.9,38.1 3.9,38.1 4.1,37.9 12.1,37.9 v19.2,30.8 19.2,31 19,31
  Bottom 0.254: SCL.TP 20.2,50.46 R2.2 | v64.3,11.5 64.3,12.5 61.1,15.7 61.1,19.4 57.3,23.2 44.5,23.2 35.4,32.3 20.7,32.3 v19.2,30.8
  other vias: 20.3,50.56
SDA  (via drill 0.6)
  Top 0.254: 23.04,50.66 R3.2 | U$2.18/A4 23.49,54.81 24.9,53.4 24.9,51.6 24,50.7 23.4,50.7 | 23.4,50.7 22.94,50.7 R3.2 | R3.2 23.36,50.66 23.4,50.7 | POW_MEAS.3 64.11,14.11 64.1,14.1 65.7,14.1 67,12.8 67,12 v66.4,11.4 | v19.3,32.2 18.6,32.2 12.4,38.4 4.3,38.4 3.8,38.9 3.8,41.2 9.6,47 19.24,47 R3.2
  Bottom 0.254: SDA.TP R3.2 | v66.4,11.4 66.4,11.5 66.3,11.6 66,11.6 61.6,16 61.6,19.7 57.6,23.7 44.7,23.7 35.6,32.8 19.9,32.8 v19.3,32.2
  other vias: 22.9,50.66
SEL1  (via drill 0.6)
  Top 0.254: U$3.P$17 85.58,46.83 v86.6,45.8
  Bottom 0.254: QUADRATURE_DECODER.4 83.39,24.5 85,24.5 88.3,27.8 88.3,44.8 87.3,45.8 v86.6,45.8 86,46.4 80.9,46.4 SEL1.TP
SEL1_T  (via drill 0.6)
  Top 0.254: U$2.3 18.3,45.2 41.8,45.2 43.6,47 59.1,47 60.2,48.1 60.2,52.4 61.3,53.5 65.3,53.5 71.97,46.83 73.42,46.83 | U$3.P$6 73.42,46.83 | 73.42,46.83 v73.4,46.8
  Bottom 0.254: v73.4,46.8 75.2,46.8 76.3,45.7 SEL1_T.TP
SEL2  (via drill 0.6)
  Top 0.254: QUADRATURE_DECODER.17 81,29.73 81,40.6 82.1,41.7 84.1,41.7 85.3,42.9 v85.3,45.4 84.53,46.17 U$3.P$16
  Bottom 0.254: v85.3,45.4 84,44.1 SEL2.TP
SEL2_T  (via drill 0.6)
  Top 0.254: 76.42,46.1 U$3.P$7 74.78,46.17 v73.9,45.3 72.6,45.3 65,52.9 61.5,52.9 60.8,52.2 60.8,47.8 59.4,46.4 43.8,46.4 42.1,44.7 20.34,44.7 U$2.4
  Bottom 0.254: v73.9,45.3 73.9,44.9 74.7,44.1 SEL2_T.TP
V+  (via drill 0.6)
  Top 1.016: POW_MEAS.8 69.28,17.12 v68.5,17.9
  Top 1.93: FUSE_HOLDER.-VE 52.1,28.8 50.4,30.5 47.47,30.5 (+).1
  Top 2.54: POWER_RESISTOR.1 56.69,30.17 TVS_DIODE.2 56.33,30.53 (+).1 | FUSE_HOLDER.-VE 52.5,25.8 52.5,24.86 CAP82UF.2
  Bottom 1.016: 68.5,17.8 v68.5,17.9 68.5,21.9 60.4,30 47.97,30 (+).1
V-  (via drill 0.6)
  Top 1.016: POW_MEAS.7 67.53,15.38 66.8,16.1 66.8,17.3 v66.2,17.9
  Top 1.93: MOTOR_CONTROLLER.P$8 58.26,39.16 58.08,39.16 POWER_RESISTOR.2 54.27,37.77 50.4,33.9 47.48,33.9 (-).1
  Top 2.184: MOTOR_CONTROLLER.P$7 MOTOR_CONTROLLER.P$8
  Bottom 1.016: v66.2,17.9 66.3,18 66.3,21.4 59.5,28.2 48.6,28.2 48.4,28 46.7,28 45.2,29.5 45.2,31.7 (-).1
W1
  Top 1.93: MOTOR_CONTROLLER.P$1 MOTOR_CONTROLLER.P$2 66,40.91 66,37
  Top 2.54: MOTOR_WINDINGS.1 7.65,7.05 11,3.7 37.4,3.7 42.7,9 58.7,9 61.1,11.4 61.1,19.1 63.3,19.1 66,21.8 66,37 66,37.5
W2  (via drill 0.6)
  Top 1.93: MOTOR_CONTROLLER.P$4 MOTOR_CONTROLLER.P$3 63.34,44.73 64.5,45.9
  Top 2.54: v71.4,18.8 71.4,18.9 69.7,20.6 69.7,44.7 67.6,46.8 65.3,46.8 64.5,46 64.5,45.9
  Bottom 2.54: MOTOR_WINDINGS.2 7.58,12.1 7.58,13.02 3.7,16.9 3.7,29.7 8.5,34.5 36.3,34.5 45.4,25.4 58.3,25.4 63.3,20.4 63.3,16.7 65.1,14.9 69,14.9 71.4,17.3 v71.4,18.8
W3
  Top 1.93: MOTOR_CONTROLLER.P$6 MOTOR_CONTROLLER.P$5 | MOTOR_CONTROLLER.P$6 | MOTOR_CONTROLLER.P$6 60.8,38.91 61.4,38.3
  Top 2.54: MOTOR_WINDINGS.3 13.13,7.2 35.6,7.2 41.3,12.9 56.8,12.9 57.8,13.9 57.8,20.7 59.7,22.6 61.4,22.6 62.2,23.4 62.2,37.5 61.4,38.3

### Text on the board
tPlace: DCG | SUTD | Teensy V1
Document: By Aaron Chong Tze Hao, 20/4/2016 / This board file is released under the / Creative Commons ShareAlike 4.0 International license.